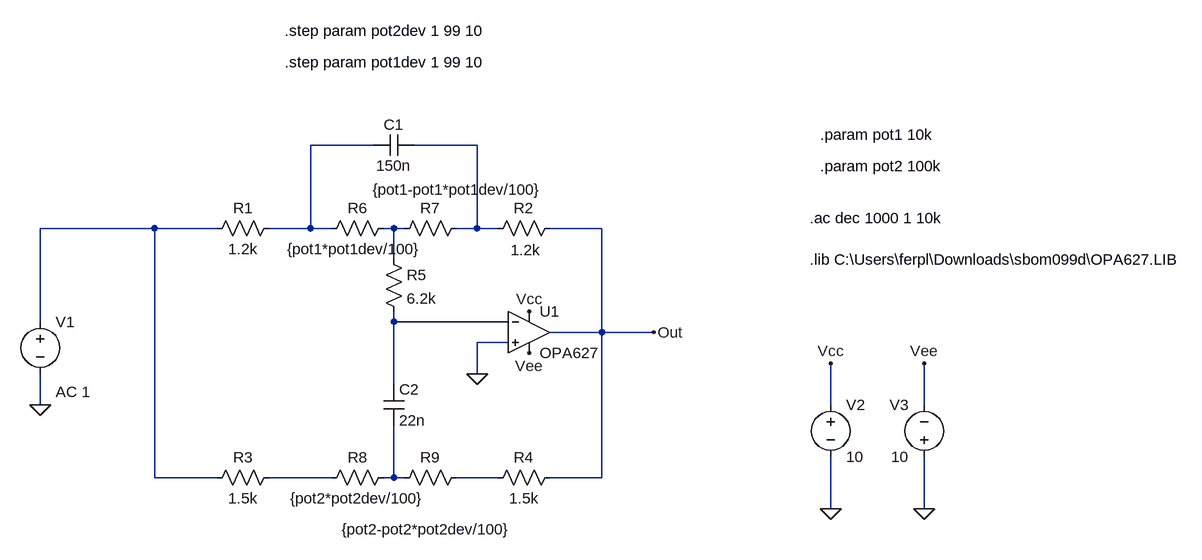
[diagram p0: schematic Baxandall.asc]
Baxandall.asc, the LTspice schematic file:
Version 4
SHEET 1 1412 680
WIRE 96 -160 0 -160
WIRE 256 -160 160 -160
WIRE -240 -32 -416 -32
WIRE -144 -32 -240 -32
WIRE 0 -32 0 -160
WIRE 0 -32 -64 -32
WIRE 32 -32 0 -32
WIRE 128 -32 112 -32
WIRE 144 -32 128 -32
WIRE 256 -32 256 -160
WIRE 256 -32 224 -32
WIRE 288 -32 256 -32
WIRE 448 -32 368 -32
WIRE 128 16 128 -32
WIRE -416 112 -416 -32
WIRE 128 112 128 96
WIRE 304 112 128 112
WIRE 448 128 448 -32
WIRE 448 128 368 128
WIRE 528 128 448 128
WIRE 304 144 256 144
WIRE 256 192 256 144
WIRE 128 208 128 112
WIRE -416 240 -416 192
WIRE 800 240 800 176
WIRE 944 240 944 176
WIRE -240 352 -240 -32
WIRE -144 352 -240 352
WIRE 32 352 -64 352
WIRE 128 352 128 272
WIRE 128 352 112 352
WIRE 144 352 128 352
WIRE 288 352 224 352
WIRE 448 352 448 128
WIRE 448 352 368 352
WIRE 800 400 800 320
WIRE 944 400 944 320
FLAG 256 192 0
FLAG 528 128 Out
FLAG -416 240 0
FLAG 800 176 Vcc
FLAG 944 176 Vee
FLAG 336 160 Vee
FLAG 800 400 0
FLAG 944 400 0
FLAG 336 96 Vcc
SYMBOL OpAmps\\opamp2 336 64 R0
SYMATTR InstName U1
SYMATTR Value OPA627
SYMBOL res -48 -48 R90
WINDOW 0 0 56 VBottom 2
WINDOW 3 32 56 VTop 2
SYMATTR InstName R1
SYMATTR Value 1.2k
SYMBOL res 384 -48 R90
WINDOW 0 0 56 VBottom 2
WINDOW 3 34 53 VTop 2
SYMATTR InstName R2
SYMATTR Value 1.2k
SYMBOL res -48 336 R90
WINDOW 0 0 56 VBottom 2
WINDOW 3 32 56 VTop 2
SYMATTR InstName R3
SYMATTR Value 1.5k
SYMBOL res 384 336 R90
WINDOW 0 0 56 VBottom 2
WINDOW 3 32 56 VTop 2
SYMATTR InstName R4
SYMATTR Value 1.5k
SYMBOL cap 160 -176 R90
WINDOW 0 0 32 VBottom 2
WINDOW 3 32 32 VTop 2
SYMATTR InstName C1
SYMATTR Value 150n
SYMBOL cap 112 208 R0
SYMATTR InstName C2
SYMATTR Value 22n
SYMBOL res 112 0 R0
SYMATTR InstName R5
SYMATTR Value 6.2k
SYMBOL res 128 -48 R90
WINDOW 0 0 56 VBottom 2
WINDOW 3 32 61 VTop 2
SYMATTR InstName R6
SYMATTR Value {pot1*pot1dev/100}
SYMBOL res 240 -48 R90
WINDOW 0 0 56 VBottom 2
WINDOW 3 -59 14 VTop 2
SYMATTR InstName R7
SYMATTR Value {pot1-pot1*pot1dev/100}
SYMBOL res 128 336 R90
WINDOW 0 0 56 VBottom 2
WINDOW 3 32 56 VTop 2
SYMATTR InstName R8
SYMATTR Value {pot2*pot2dev/100}
SYMBOL res 240 336 R90
WINDOW 0 0 56 VBottom 2
WINDOW 3 80 61 VTop 2
SYMATTR InstName R9
SYMATTR Value {pot2-pot2*pot2dev/100}
SYMBOL voltage -416 96 R0
WINDOW 123 24 124 Left 2
WINDOW 39 0 0 Left 0
SYMATTR InstName V1
SYMATTR Value ""
SYMATTR Value2 AC 1
SYMBOL voltage 800 224 R0
WINDOW 123 0 0 Left 0
WINDOW 39 0 0 Left 0
SYMATTR InstName V2
SYMATTR Value 10
SYMBOL voltage 944 336 R180
WINDOW 0 24 96 Left 2
WINDOW 3 24 16 Left 2
WINDOW 123 0 0 Left 0
WINDOW 39 0 0 Left 0
SYMATTR InstName V3
SYMATTR Value 10
TEXT 768 16 Left 2 !.lib C:\\Users\\ferpl\\Downloads\\sbom099d\\OPA627.LIB
TEXT 768 -48 Left 2 !.ac dec 1000 1 10k
TEXT 784 -176 Left 2 !.param pot1 10k
TEXT 784 -128 Left 2 !.param pot2 100k
TEXT -40 -288 Left 2 !.step param pot1dev 1 99 10
TEXT -40 -336 Left 2 !.step param pot2dev 1 99 10

The netlist it stands for:
* Baxandall.asc
XU1 0 N005 Vcc Vee Out OPA627  ; pins In+ In- V+ V- OUT
R1 N001 N003 1.2k
R2 Out N002 1.2k
R3 N006 N003 1.5k
R4 Out N008 1.5k
C1 N002 N001 150n
C2 N005 N007 22n
R5 N004 N005 6.2k
R6 N004 N001 {pot1*pot1dev/100}
R7 N002 N004 {pot1-pot1*pot1dev/100}
R8 N007 N006 {pot2*pot2dev/100}
R9 N008 N007 {pot2-pot2*pot2dev/100}
V1 N003 0 AC 1
V2 Vcc 0 10
V3 0 Vee 10
.lib C:\Users\ferpl\Downloads\sbom099d\OPA627.LIB
.ac dec 1000 1 10k
.param pot1 10k
.param pot2 100k
.step param pot1dev 1 99 10
.step param pot2dev 1 99 10
.backanno
.end